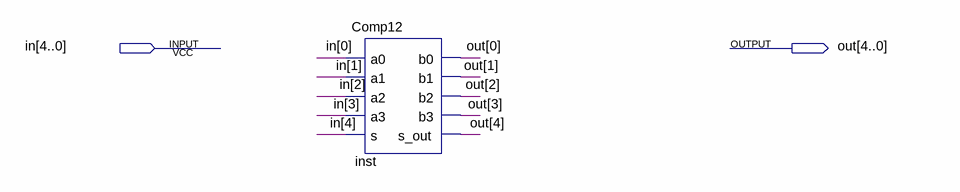
[diagram p0: schematic sheet]
// Quartus schematic ULA_comp.bdf as structural Verilog: 1 symbols, 2 pins
module ULA_comp (
  input  [4:0] in,
  output [4:0] out
);

  Comp12 inst (
    .a0(in[0]), .a1(in[1]), .a2(in[2]), .a3(in[3]), .s(in[4]), .b0(out[0]), .b1(out[1]), .b2(out[2]),
    .b3(out[3]), .s_out(out[4]));
endmodule
